# Altium project 100835_project.prjpcb (part 1 of 2)
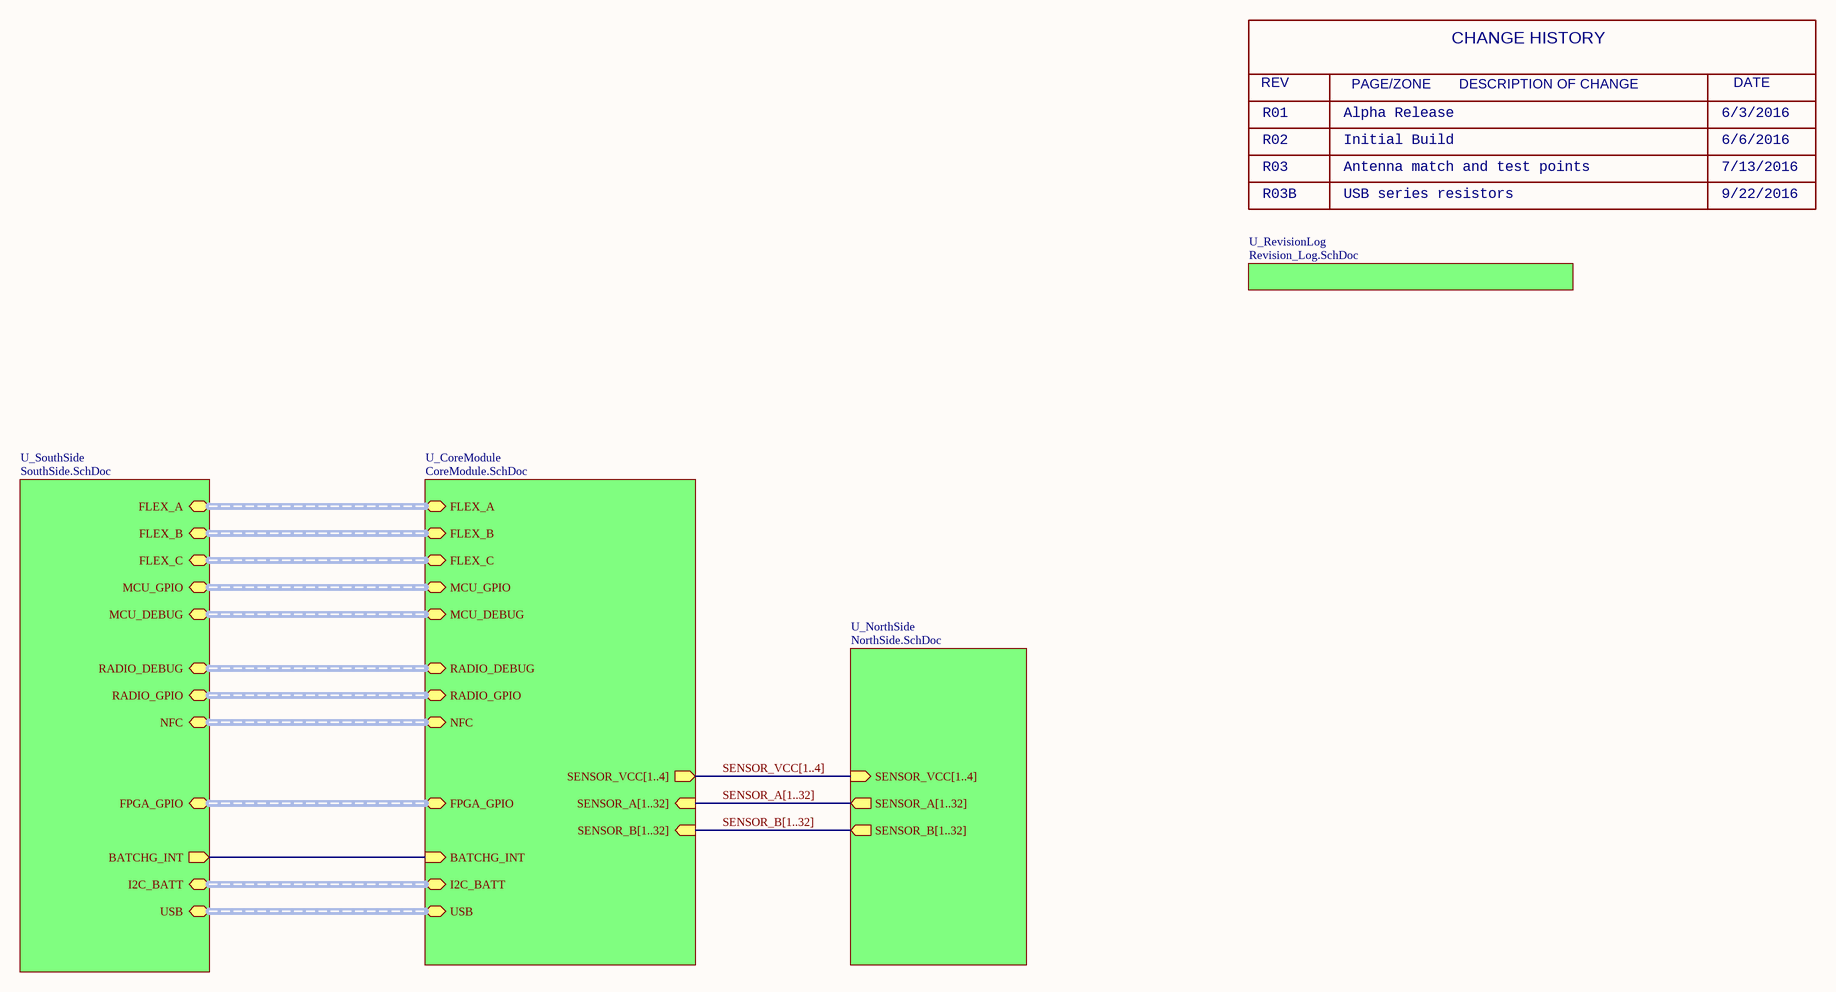
[diagram p0: CoreModuleTopLevel.SchDoc]
Sch_Revision: 03B; Project_Name: Watchman; PCB_Revision: 03; Board_Number: 100835; Board_Name: Core Module iCE40
10 sheets, 145 parts. Net scope: hierarchical (ports join the sheet entries above them; power ports are global).
Board file: 606-100835.PcbDoc
Sheets:
  CoreModuleTopLevel.SchDoc
    U_NorthSide = NorthSide.SchDoc
    U_CoreModule = CoreModule.SchDoc
      U_FPGA_Power = FPGA_Power.SchDoc
      U_FPGA_IO = FPGA_IO.SchDoc
      U_PowerCore = PowerCore.SchDoc
      U_MCU_IMU = MCU_IMU.SchDoc
      U_RADIO = Radio.SchDoc
    U_SouthSide = SouthSide.SchDoc
    U_RevisionLog = Revision_Log.SchDoc

## Sheet CoreModuleTopLevel.SchDoc: Block Diagram
size 431 x 279 mm; DrawnBy: D. Bruey, M.Ciuffo; Organization: Synapse Product Development, LLC.; Address1: 1511 6th Ave., Suite 400; Address2: Seattle, Washington 98101; Address3: 206.381.0898; Address4: www.synapse.com; DocumentNumber: 1; SheetNumber: 1; SheetTotal: 10; PageSetup: Record=PageOptions|CenterHorizontal=True|CenterVertical=True|PrintScale=1.06|XCorrection=1.00|YCorrection=1.00|PrintKind=1|BorderSize=5000000|LeftOffset=0|BottomOffset=0|Orientation=2|PaperLength=4318|PaperWidth=2794|Scale=100|PaperSource=7|PrintQuality=200|MediaType=1|DitherType=10|PrintScaleMode=1|PaperKind=11x17|PaperIndex=3

### Sub-sheets
U_CoreModule = CoreModule.SchDoc: SENSOR_VCC[1..4] (out), SENSOR_A[1..32] (in), SENSOR_B[1..32] (in), I2C_BATT (harness I2C), MCU_DEBUG (harness SWD), RADIO_DEBUG (harness SWD), USB (harness USB), MCU_GPIO (harness MCU_IO), FLEX_C (harness SPI), FLEX_B (harness SPI), FLEX_A (harness SPI), RADIO_GPIO (harness RADIO_IO), BATCHG_INT (in), FPGA_GPIO (harness FPGA_IO), NFC (harness NFC)
U_NorthSide = NorthSide.SchDoc: SENSOR_A[1..32] (out), SENSOR_B[1..32] (out), SENSOR_VCC[1..4] (in)
U_RevisionLog = Revision_Log.SchDoc: no entries
U_SouthSide = SouthSide.SchDoc: I2C_BATT (harness I2C), MCU_DEBUG (harness SWD), RADIO_DEBUG (harness SWD), USB (harness USB), MCU_GPIO (harness MCU_IO), FLEX_C (harness SPI), FLEX_B (harness SPI), FLEX_A (harness SPI), RADIO_GPIO (harness RADIO_IO), BATCHG_INT (out), FPGA_GPIO (harness FPGA_IO), NFC (harness NFC)

### Nets
BATCHG_INT: sheet U_CoreModule/BATCHG_INT, sheet U_SouthSide/BATCHG_INT

### Buses and harness runs
bus SENSOR_A[1..32] = sheet U_CoreModule/SENSOR_A[1..32] = sheet U_NorthSide/SENSOR_A[1..32]
bus SENSOR_B[1..32] = sheet U_CoreModule/SENSOR_B[1..32] = sheet U_NorthSide/SENSOR_B[1..32]
bus SENSOR_VCC[1..4] = sheet U_CoreModule/SENSOR_VCC[1..4] = sheet U_NorthSide/SENSOR_VCC[1..4]
harness sheet U_CoreModule/FLEX_A = sheet U_SouthSide/FLEX_A
harness sheet U_CoreModule/FLEX_B = sheet U_SouthSide/FLEX_B
harness sheet U_CoreModule/FLEX_C = sheet U_SouthSide/FLEX_C
harness sheet U_CoreModule/FPGA_GPIO = sheet U_SouthSide/FPGA_GPIO
harness sheet U_CoreModule/I2C_BATT = sheet U_SouthSide/I2C_BATT
harness sheet U_CoreModule/MCU_DEBUG = sheet U_SouthSide/MCU_DEBUG
harness sheet U_CoreModule/MCU_GPIO = sheet U_SouthSide/MCU_GPIO
harness sheet U_CoreModule/NFC = sheet U_SouthSide/NFC
harness sheet U_CoreModule/RADIO_DEBUG = sheet U_SouthSide/RADIO_DEBUG
harness sheet U_CoreModule/RADIO_GPIO = sheet U_SouthSide/RADIO_GPIO
harness sheet U_CoreModule/USB = sheet U_SouthSide/USB

### Notes on the sheet
- REV
- PAGE/ZONE       DESCRIPTION OF CHANGE
- CHANGE HISTORY
- DATE
- R01
- R02
- R03
- Alpha Release
- Initial Build
- Antenna match and test points
- 6/3/2016
- 6/6/2016
- 7/13/2016
- R03B
- USB series resistors
- 9/22/2016
- Design Notes:
- Layout Notes:
- Project:
- Sheet Title:
- PCBA:
- PROPRIETARY AND CONFIDENTIAL
- Drawn by:
- Schematic Part Number:
- Schematic Revision:
- Date:
- Sheet:
- /

## Sheet NorthSide.SchDoc: North Side Connector
size 431 x 279 mm; DrawnBy: D. Bruey, M.Ciuffo; Organization: Synapse Product Development, LLC.; Address1: 1511 6th Ave., Suite 400; Address2: Seattle, Washington 98101; Address3: 206.381.0898; Address4: www.synapse.com; DocumentNumber: 9; SheetNumber: 8; SheetTotal: 10; PageSetup: Record=PageOptions|CenterHorizontal=True|CenterVertical=True|PrintScale=1.06|XCorrection=1.00|YCorrection=1.00|PrintKind=1|BorderSize=5000000|LeftOffset=0|BottomOffset=0|Orientation=2|PaperLength=4318|PaperWidth=2794|Scale=100|PaperSource=7|PrintQuality=200|MediaType=1|DitherType=10|PrintScaleMode=1|PaperKind=11x17|PaperIndex=3
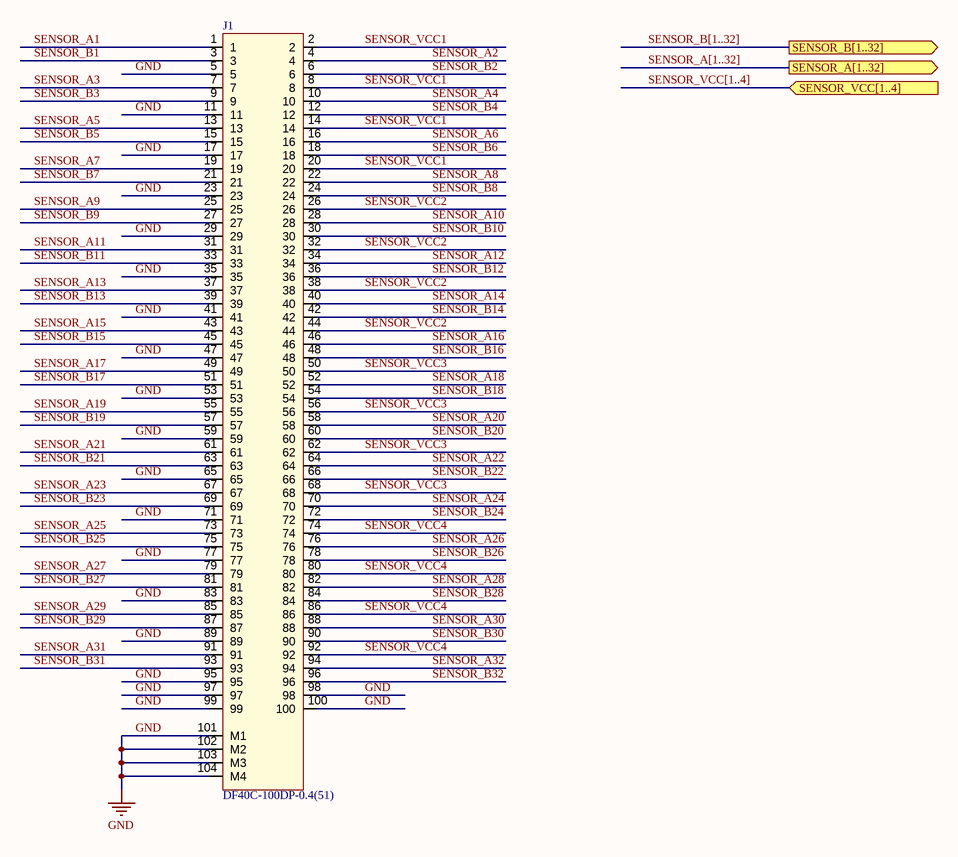
[diagram p1: NorthSide.SchDoc]

### Parts
J1  DF40C-100DP-0.4(51)  [con100_hirose-df40c-100dp_129h]

### Ports
SENSOR_A[1..32] (out), SENSOR_B[1..32] (out), SENSOR_VCC[1..4] (in)

### Nets
GND: J1.5 J1.11 J1.17 J1.23 J1.29 J1.35 J1.41 J1.47 J1.53 J1.59 J1.65 J1.71 J1.77 J1.83 J1.89 J1.95 J1.97 J1.98 J1.99 J1.100 J1.101(M1) J1.102(M2) J1.103(M3) J1.104(M4)
SENSOR_A1: J1.1
SENSOR_A2: J1.4
SENSOR_A3: J1.7
SENSOR_A4: J1.10
SENSOR_A5: J1.13
SENSOR_A6: J1.16
SENSOR_A7: J1.19
SENSOR_A8: J1.22
SENSOR_A9: J1.25
SENSOR_A10: J1.28
SENSOR_A11: J1.31
SENSOR_A12: J1.34
SENSOR_A13: J1.37
SENSOR_A14: J1.40
SENSOR_A15: J1.43
SENSOR_A16: J1.46
SENSOR_A17: J1.49
SENSOR_A18: J1.52
SENSOR_A19: J1.55
SENSOR_A20: J1.58
SENSOR_A21: J1.61
SENSOR_A22: J1.64
SENSOR_A23: J1.67
SENSOR_A24: J1.70
SENSOR_A25: J1.73
SENSOR_A26: J1.76
SENSOR_A27: J1.79
SENSOR_A28: J1.82
SENSOR_A29: J1.85
SENSOR_A30: J1.88
SENSOR_A31: J1.91
SENSOR_A32: J1.94
SENSOR_B1: J1.3
SENSOR_B2: J1.6
SENSOR_B3: J1.9
SENSOR_B4: J1.12
SENSOR_B5: J1.15
SENSOR_B6: J1.18
SENSOR_B7: J1.21
SENSOR_B8: J1.24
SENSOR_B9: J1.27
SENSOR_B10: J1.30
SENSOR_B11: J1.33
SENSOR_B12: J1.36
SENSOR_B13: J1.39
SENSOR_B14: J1.42
SENSOR_B15: J1.45
SENSOR_B16: J1.48
SENSOR_B17: J1.51
SENSOR_B18: J1.54
SENSOR_B19: J1.57
SENSOR_B20: J1.60
SENSOR_B21: J1.63
SENSOR_B22: J1.66
SENSOR_B23: J1.69
SENSOR_B24: J1.72
SENSOR_B25: J1.75
SENSOR_B26: J1.78
SENSOR_B27: J1.81
SENSOR_B28: J1.84
SENSOR_B29: J1.87
SENSOR_B30: J1.90
SENSOR_B31: J1.93
SENSOR_B32: J1.96
SENSOR_VCC1: J1.2 J1.8 J1.14 J1.20
SENSOR_VCC2: J1.26 J1.32 J1.38 J1.44
SENSOR_VCC3: J1.50 J1.56 J1.62 J1.68
SENSOR_VCC4: J1.74 J1.80 J1.86 J1.92

### Buses and harness runs
bus SENSOR_A[1..32] = port SENSOR_A[1..32]
bus SENSOR_B[1..32] = port SENSOR_B[1..32]
bus SENSOR_VCC[1..4] = port SENSOR_VCC[1..4]

### Notes on the sheet
- Design Notes:
- Layout Notes:
- Project:
- Sheet Title:
- PCBA:
- PROPRIETARY AND CONFIDENTIAL
- Drawn by:
- Schematic Part Number:
- Schematic Revision:
- Date:
- Sheet:
- /

### Library data of the parts
J1 = DF40C-100DP-0.4(51): CONN HDR 100POS 0.4MM SMD GOLD; part_type: connector; id: 1582; mfg: Hirose; dist: Digikey; dist_pn: H11614CT-ND; symbol: \\synapsedev.com\dfs\FS\EE_STUFF\CAD_LIB\MASTER\MASTER_CON\DF40C-100DP-0.4(51); voltage: 30V; positions: 100; TableName: viewAltiumConnectors; mfg_pn: DF40C-100DP-0.4(51); allegro_footprint: con100_hirose-df40c-100dp_129h; source_package: DF40C-100DP-0.4(51); height: 1.14mm; status: Unknown; datasheet: http://www.hirose.co.jp/cataloge_hp/ed_DF40_20140305.pdf

## Sheet CoreModule.SchDoc: Core Module
size 431 x 279 mm; DrawnBy: D. Bruey, M.Ciuffo; Organization: Synapse Product Development, LLC.; Address1: 1511 6th Ave., Suite 400; Address2: Seattle, Washington 98101; Address3: 206.381.0898; Address4: www.synapse.com; SheetNumber: 2; SheetTotal: 10; PageSetup: Record=PageOptions|CenterHorizontal=True|CenterVertical=True|PrintScale=1.06|XCorrection=1.00|YCorrection=1.00|PrintKind=1|BorderSize=5000000|LeftOffset=0|BottomOffset=0|Orientation=2|PaperLength=4318|PaperWidth=2794|Scale=100|PaperSource=7|PrintQuality=200|MediaType=1|DitherType=10|PrintScaleMode=1|PaperKind=11x17|PaperIndex=3
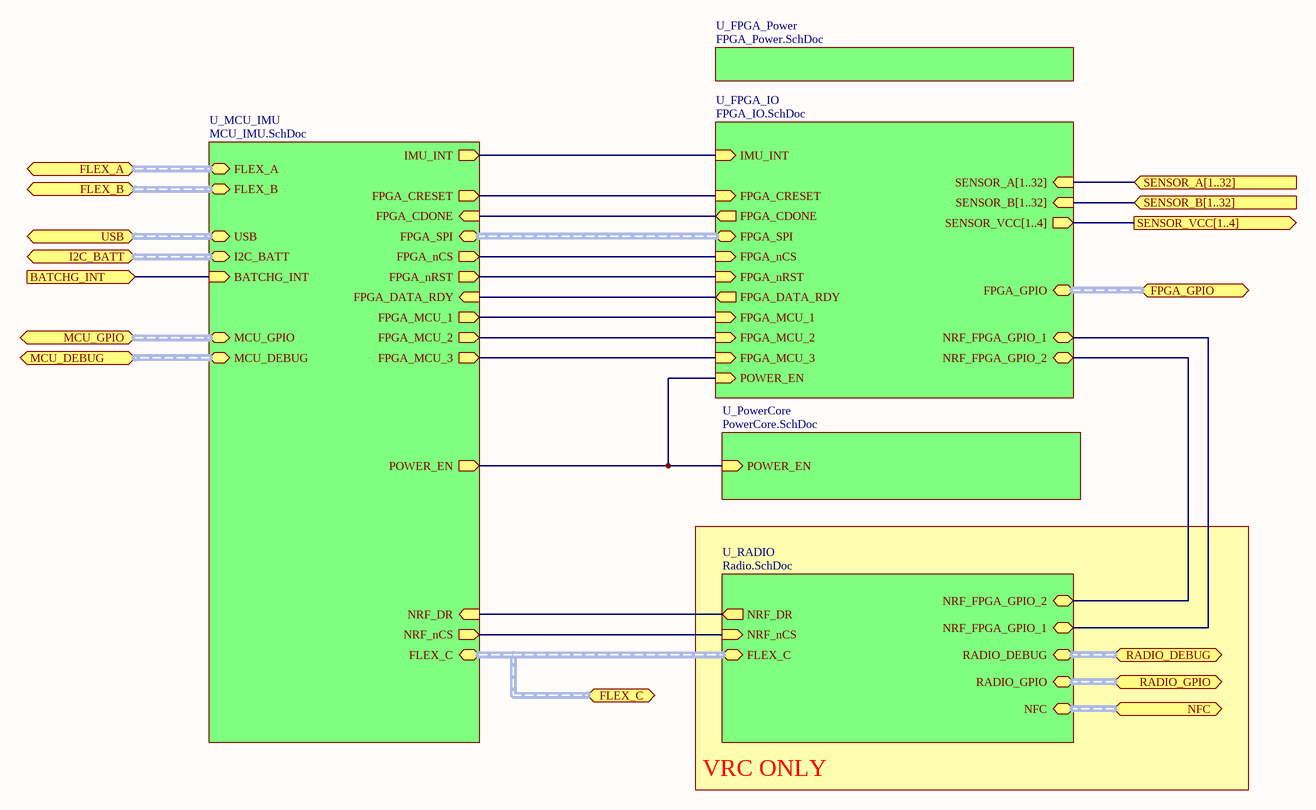
[diagram p2: CoreModule.SchDoc]

### Sub-sheets
U_FPGA_IO = FPGA_IO.SchDoc: FPGA_SPI (harness SPI), FPGA_nCS (in), IMU_INT (in), POWER_EN (in), FPGA_GPIO (harness FPGA_IO), FPGA_MCU_1 (in), FPGA_MCU_2 (in), FPGA_MCU_3 (in), FPGA_nRST (in), FPGA_CRESET (in), FPGA_DATA_RDY (out), FPGA_CDONE (out), NRF_FPGA_GPIO_1 (bidir), NRF_FPGA_GPIO_2 (bidir), SENSOR_VCC[1..4] (out), SENSOR_B[1..32] (in), SENSOR_A[1..32] (in)
U_FPGA_Power = FPGA_Power.SchDoc: no entries
U_MCU_IMU = MCU_IMU.SchDoc: I2C_BATT (harness I2C), USB (harness USB), FLEX_A (harness SPI), FLEX_B (harness SPI), FLEX_C (harness SPI), FPGA_SPI (harness SPI), FPGA_nCS (out), IMU_INT (out), POWER_EN (out), NRF_DR (in), MCU_GPIO (harness MCU_IO), NRF_nCS (out), BATCHG_INT (in), FPGA_MCU_1 (out), FPGA_MCU_2 (out), FPGA_MCU_3 (out), FPGA_nRST (out), FPGA_DATA_RDY (in), FPGA_CRESET (out), FPGA_CDONE (in), MCU_DEBUG (harness SWD)
U_PowerCore = PowerCore.SchDoc: POWER_EN (in)
U_RADIO = Radio.SchDoc: NRF_nCS (in), RADIO_DEBUG (harness SWD), FLEX_C (harness SPI), RADIO_GPIO (harness RADIO_IO), NFC (harness NFC), NRF_FPGA_GPIO_1 (bidir), NRF_FPGA_GPIO_2 (bidir), NRF_DR (out)

### Ports
BATCHG_INT (in), FLEX_A (harness SPI), FLEX_B (harness SPI), FLEX_C (harness SPI), FPGA_GPIO (harness FPGA_IO), I2C_BATT (harness I2C), MCU_DEBUG (harness SWD), MCU_GPIO (harness MCU_IO), NFC (harness NFC), RADIO_DEBUG (harness SWD), RADIO_GPIO (harness RADIO_IO), SENSOR_A[1..32] (in), SENSOR_B[1..32] (in), SENSOR_VCC[1..4] (out), USB (harness USB)

### Nets
BATCHG_INT: port BATCHG_INT, sheet U_MCU_IMU/BATCHG_INT
FPGA_CDONE: sheet U_FPGA_IO/FPGA_CDONE, sheet U_MCU_IMU/FPGA_CDONE
FPGA_CRESET: sheet U_FPGA_IO/FPGA_CRESET, sheet U_MCU_IMU/FPGA_CRESET
FPGA_DATA_RDY: sheet U_FPGA_IO/FPGA_DATA_RDY, sheet U_MCU_IMU/FPGA_DATA_RDY
FPGA_MCU_1: sheet U_FPGA_IO/FPGA_MCU_1, sheet U_MCU_IMU/FPGA_MCU_1
FPGA_MCU_2: sheet U_FPGA_IO/FPGA_MCU_2, sheet U_MCU_IMU/FPGA_MCU_2
FPGA_MCU_3: sheet U_FPGA_IO/FPGA_MCU_3, sheet U_MCU_IMU/FPGA_MCU_3
FPGA_nCS: sheet U_FPGA_IO/FPGA_nCS, sheet U_MCU_IMU/FPGA_nCS
FPGA_nRST: sheet U_FPGA_IO/FPGA_nRST, sheet U_MCU_IMU/FPGA_nRST
IMU_INT: sheet U_FPGA_IO/IMU_INT, sheet U_MCU_IMU/IMU_INT
NRF_DR: sheet U_MCU_IMU/NRF_DR, sheet U_RADIO/NRF_DR
NRF_FPGA_GPIO_1: sheet U_FPGA_IO/NRF_FPGA_GPIO_1, sheet U_RADIO/NRF_FPGA_GPIO_1
NRF_FPGA_GPIO_2: sheet U_FPGA_IO/NRF_FPGA_GPIO_2, sheet U_RADIO/NRF_FPGA_GPIO_2
NRF_nCS: sheet U_MCU_IMU/NRF_nCS, sheet U_RADIO/NRF_nCS
POWER_EN: sheet U_FPGA_IO/POWER_EN, sheet U_PowerCore/POWER_EN, sheet U_MCU_IMU/POWER_EN

### Buses and harness runs
bus port SENSOR_A[1..32] = sheet U_FPGA_IO/SENSOR_A[1..32]
bus port SENSOR_B[1..32] = sheet U_FPGA_IO/SENSOR_B[1..32]
bus port SENSOR_VCC[1..4] = sheet U_FPGA_IO/SENSOR_VCC[1..4]
harness port FLEX_A = sheet U_MCU_IMU/FLEX_A
harness port FLEX_B = sheet U_MCU_IMU/FLEX_B
harness port FLEX_C = sheet U_MCU_IMU/FLEX_C = sheet U_RADIO/FLEX_C
harness port FPGA_GPIO = sheet U_FPGA_IO/FPGA_GPIO
harness port I2C_BATT = sheet U_MCU_IMU/I2C_BATT
harness port MCU_DEBUG = sheet U_MCU_IMU/MCU_DEBUG
harness port MCU_GPIO = sheet U_MCU_IMU/MCU_GPIO
harness port NFC = sheet U_RADIO/NFC
harness port RADIO_DEBUG = sheet U_RADIO/RADIO_DEBUG
harness port RADIO_GPIO = sheet U_RADIO/RADIO_GPIO
harness port USB = sheet U_MCU_IMU/USB
harness sheet U_FPGA_IO/FPGA_SPI = sheet U_MCU_IMU/FPGA_SPI

### Notes on the sheet
- VRC ONLY
- Design Notes:
- Layout Notes:
- Project:
- Sheet Title:
- PCBA:
- PROPRIETARY AND CONFIDENTIAL
- Drawn by:
- Schematic Part Number:
- Schematic Revision:
- Date:
- Sheet:
- /

## Sheet FPGA_Power.SchDoc: FPGA Power
size 431 x 279 mm; DrawnBy: D. Bruey, M.Ciuffo; Organization: Synapse Product Development, LLC.; Address1: 1511 6th Ave., Suite 400; Address2: Seattle, Washington 98101; Address3: 206.381.0898; Address4: www.synapse.com; DocumentNumber: 4; SheetNumber: 4; SheetTotal: 10; PageSetup: Record=PageOptions|CenterHorizontal=True|CenterVertical=True|PrintScale=1.06|XCorrection=1.00|YCorrection=1.00|PrintKind=1|BorderSize=5000000|LeftOffset=0|BottomOffset=0|Orientation=2|PaperLength=4318|PaperWidth=2794|Scale=100|PaperSource=7|PrintQuality=200|MediaType=1|DitherType=10|PrintScaleMode=1|PaperKind=11x17|PaperIndex=3
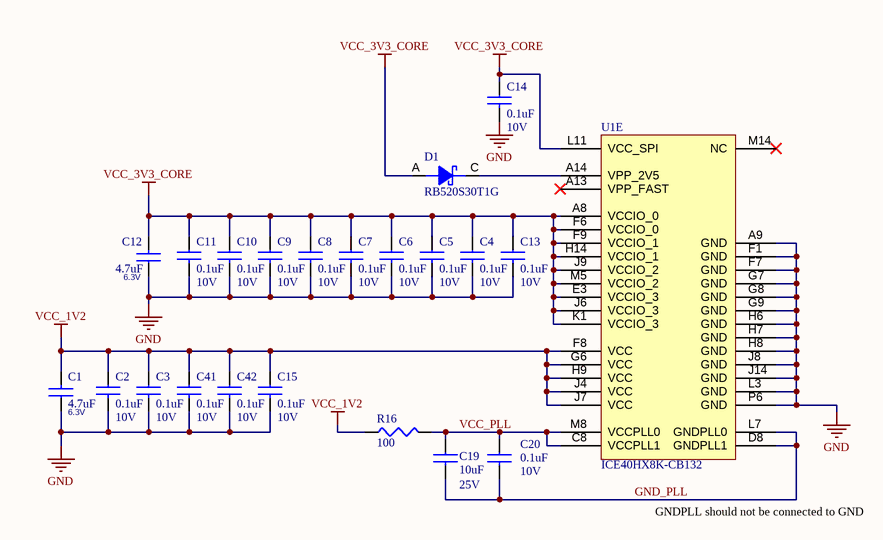
[diagram p3: FPGA_Power.SchDoc]

### Parts
C1  4.7uF  Voltage: 6.3V  [0402-IPCsm_55]
C2  0.1uF  Voltage: 10V  [0201-IPCsm_33]
C3  0.1uF  Voltage: 10V  [0201-IPCsm_33]
C4  0.1uF  Voltage: 10V  [0201-IPCsm_33]
C5  0.1uF  Voltage: 10V  [0201-IPCsm_33]
C6  0.1uF  Voltage: 10V  [0201-IPCsm_33]
C7  0.1uF  Voltage: 10V  [0201-IPCsm_33]
C8  0.1uF  Voltage: 10V  [0201-IPCsm_33]
C9  0.1uF  Voltage: 10V  [0201-IPCsm_33]
C10  0.1uF  Voltage: 10V  [0201-IPCsm_33]
C11  0.1uF  Voltage: 10V  [0201-IPCsm_33]
C12  4.7uF  Voltage: 6.3V  [0402-IPCsm_55]
C13  0.1uF  Voltage: 10V  [0201-IPCsm_33]
C14  0.1uF  Voltage: 10V  [0201-IPCsm_33]
C15  0.1uF  Voltage: 10V  [0201-IPCsm_33]
C19  10uF  Voltage: 25V  [0603-ipcsm_90]
C20  0.1uF  Voltage: 10V  [0201-IPCsm_33]
C41  0.1uF  Voltage: 10V  [0201-IPCsm_33]
C42  0.1uF  Voltage: 10V  [0201-IPCsm_33]
D1  RB520S30T1G  [SOD523]
R16  100  [0201-IPCsm_26]
U1  ICE40HX8K-CB132  [LATC-csBGA-132]  (part E of 5)

### Nets
GND: C1.1 C2.2 C3.2 C4.2 C5.2 C6.2 C7.2 C8.2 C9.2 C10.2 C11.2 C12.1 C13.2 C14.2 C15.2 C41.2 C42.2 U1.A9(GND) U1.F1(GND) U1.F7(GND) U1.G7(GND) U1.G8(GND) U1.G9(GND) U1.H6(GND) U1.H7(GND) U1.H8(GND) U1.J8(GND) U1.J14(GND) U1.L3(GND) U1.P6(GND)
VCC_1V2: C1.2 C2.1 C3.1 C15.1 C41.1 C42.1 R16.1 U1.F8(VCC) U1.G6(VCC) U1.H9(VCC) U1.J4(VCC) U1.J7(VCC)
VCC_3V3_CORE: C4.1 C5.1 C6.1 C7.1 C8.1 C9.1 C10.1 C11.1 C12.2 C13.1 C14.1 D1.A U1.A8(VCCIO_0) U1.E3(VCCIO_3) U1.F6(VCCIO_0) U1.F9(VCCIO_1) U1.H14(VCCIO_1) U1.J6(VCCIO_3) U1.J9(VCCIO_2) U1.K1(VCCIO_3) U1.L11(VCC_SPI) U1.M5(VCCIO_2)
GND_PLL: C19.2 C20.2 U1.D8(GNDPLL1) U1.L7(GNDPLL0)
VCC_PLL: C19.1 C20.1 R16.2 U1.C8(VCCPLL1) U1.M8(VCCPLL0)
NetD1_C: D1.C U1.A14(VPP_2V5)

Not connected (* = marked no-connect by the designer): U1 A13(VPP_FAST)* M14(NC)*

### Notes on the sheet
- GNDPLL should not be connected to GND
- Design Notes:
- Layout Notes:
- Project:
- Sheet Title:
- PCBA:
- PROPRIETARY AND CONFIDENTIAL
- Drawn by:
- Schematic Part Number:
- Schematic Revision:
- Date:
- Sheet:
- /

### Library data of the parts
C1 C12 = GRM155R60J475ME47D: CAP CER 4.7UF 6.3V 20% X5R 0402; part_type: capacitor; id: 855; mfg: MURATA; dist: DIGIKEY; dist_pn: 490-5915-1-ND; symbol: \\SYNAPSEDEV.COM\DFS\FS\EE_STUFF\CAD_LIB\MASTER\MASTER_DISCRETE\CAP; allegro_footprint: 0402-IPCsm_55,c-0402_22H; source_package: C_4P7U_6.3V_X5R_0402; OrCADSymbol: MASTER_DISCRETE\CAP; TableName: viewAltiumCapacitors; mfg_pn: GRM155R60J475ME47D; type: X5R; tolerance: 20%; height: 0.55MM; status: Unknown; SymbolPath: C:\EE-Vault\Libraries\Schematic\MASTER_DISCRETE\CAP
C2-C11 C13-C15 C20 C41 C42 = CL03A104KP3NNNC: CAP CER 0.1UF 10V 10% X5R 0201; part_type: capacitor; id: 1260; mfg: Samsung Electro-Mechanics America, Inc; dist: DIGIKEY; dist_pn: 1276-1115-2-ND; source_package: C_1U_10V_X5R_0201; TableName: viewAltiumCapacitors; mfg_pn: CL03A104KP3NNNC; type: X5R; tolerance: 10%; height: 0.33mm; status: Unknown
C19 = CL10A106MA8NRNC: CAP CER 10UF 25V 20% X5R 0603; part_type: capacitor; id: 1157; mfg: Samsung Electro-Mechanics America, Inc; dist: Digikey; dist_pn: 1276-1869-1-ND; TableName: viewAltiumCapacitors; mfg_pn: CL10A106MA8NRNC; type: X5R; tolerance: 20%; height: 0.9MM; status: Unknown
D1 = RB520S30T1G: DIODE SCHOTTKY 30V 200MA SOD523; id: 1259; mfg: On Semiconductor; dist: Digikey; dist_pn: RB520S30T1GOSCT-ND; source_package: SOD-523; power: 200mW; current: 0.2A; TableName: viewAltiumDiscretes; mfg_pn: RB520S30T1G; part_type: Diode; voltage: 30V; type: SCHOTTKY; height: 0.7mm; status: Unknown
R16 = RC0201FR-07100RL: RES 100 OHM 1/20W 1% 0201 SMD; part_type: resistor; Tolerance: 1.00%; Voltage: 50V; DIST: DIGIKEY; MFG: YAGEO; DIST_PN: 311-100MCT-ND; Power: 0.05W; id: 2416; source_package: R_100_0201_1P; TableName: viewAltiumResistors; Height: 0.26MM; MFG_PN: RC0201FR-07100RL; status: Unknown; datasheet: http://www.yageo.com/documents/recent/PYu-RC_Group_51_RoHS_L_04.pdf
U1 = ICE40HX8K-CB132: IC FPGA 95 I/O 132CBGA; id: 2469; mfg: Lattice Semiconductor Corporation; dist: Digikey; dist_pn: 220-1577-ND; source_package: ICE40HX8K_CB132; voltage: 1.2-3.3v; TableName: viewAltiumIcs; mfg_pn: ICE40HX8K-CB132; part_type: ic; height: 1mm; status: Unknown

## Sheet FPGA_IO.SchDoc: FPGA IO
size 431 x 279 mm; DrawnBy: D. Bruey, M.Ciuffo; Organization: Synapse Product Development, LLC.; Address1: 1511 6th Ave., Suite 400; Address2: Seattle, Washington 98101; Address3: 206.381.0898; Address4: www.synapse.com; DocumentNumber: 5; SheetNumber: 3; SheetTotal: 10; PageSetup: Record=PageOptions|CenterHorizontal=True|CenterVertical=True|PrintScale=1.06|XCorrection=1.00|YCorrection=1.00|PrintKind=1|BorderSize=5000000|LeftOffset=0|BottomOffset=0|Orientation=2|PaperLength=4318|PaperWidth=2794|Scale=100|PaperSource=7|PrintQuality=200|MediaType=1|DitherType=10|PrintScaleMode=1|PaperKind=11x17|PaperIndex=3
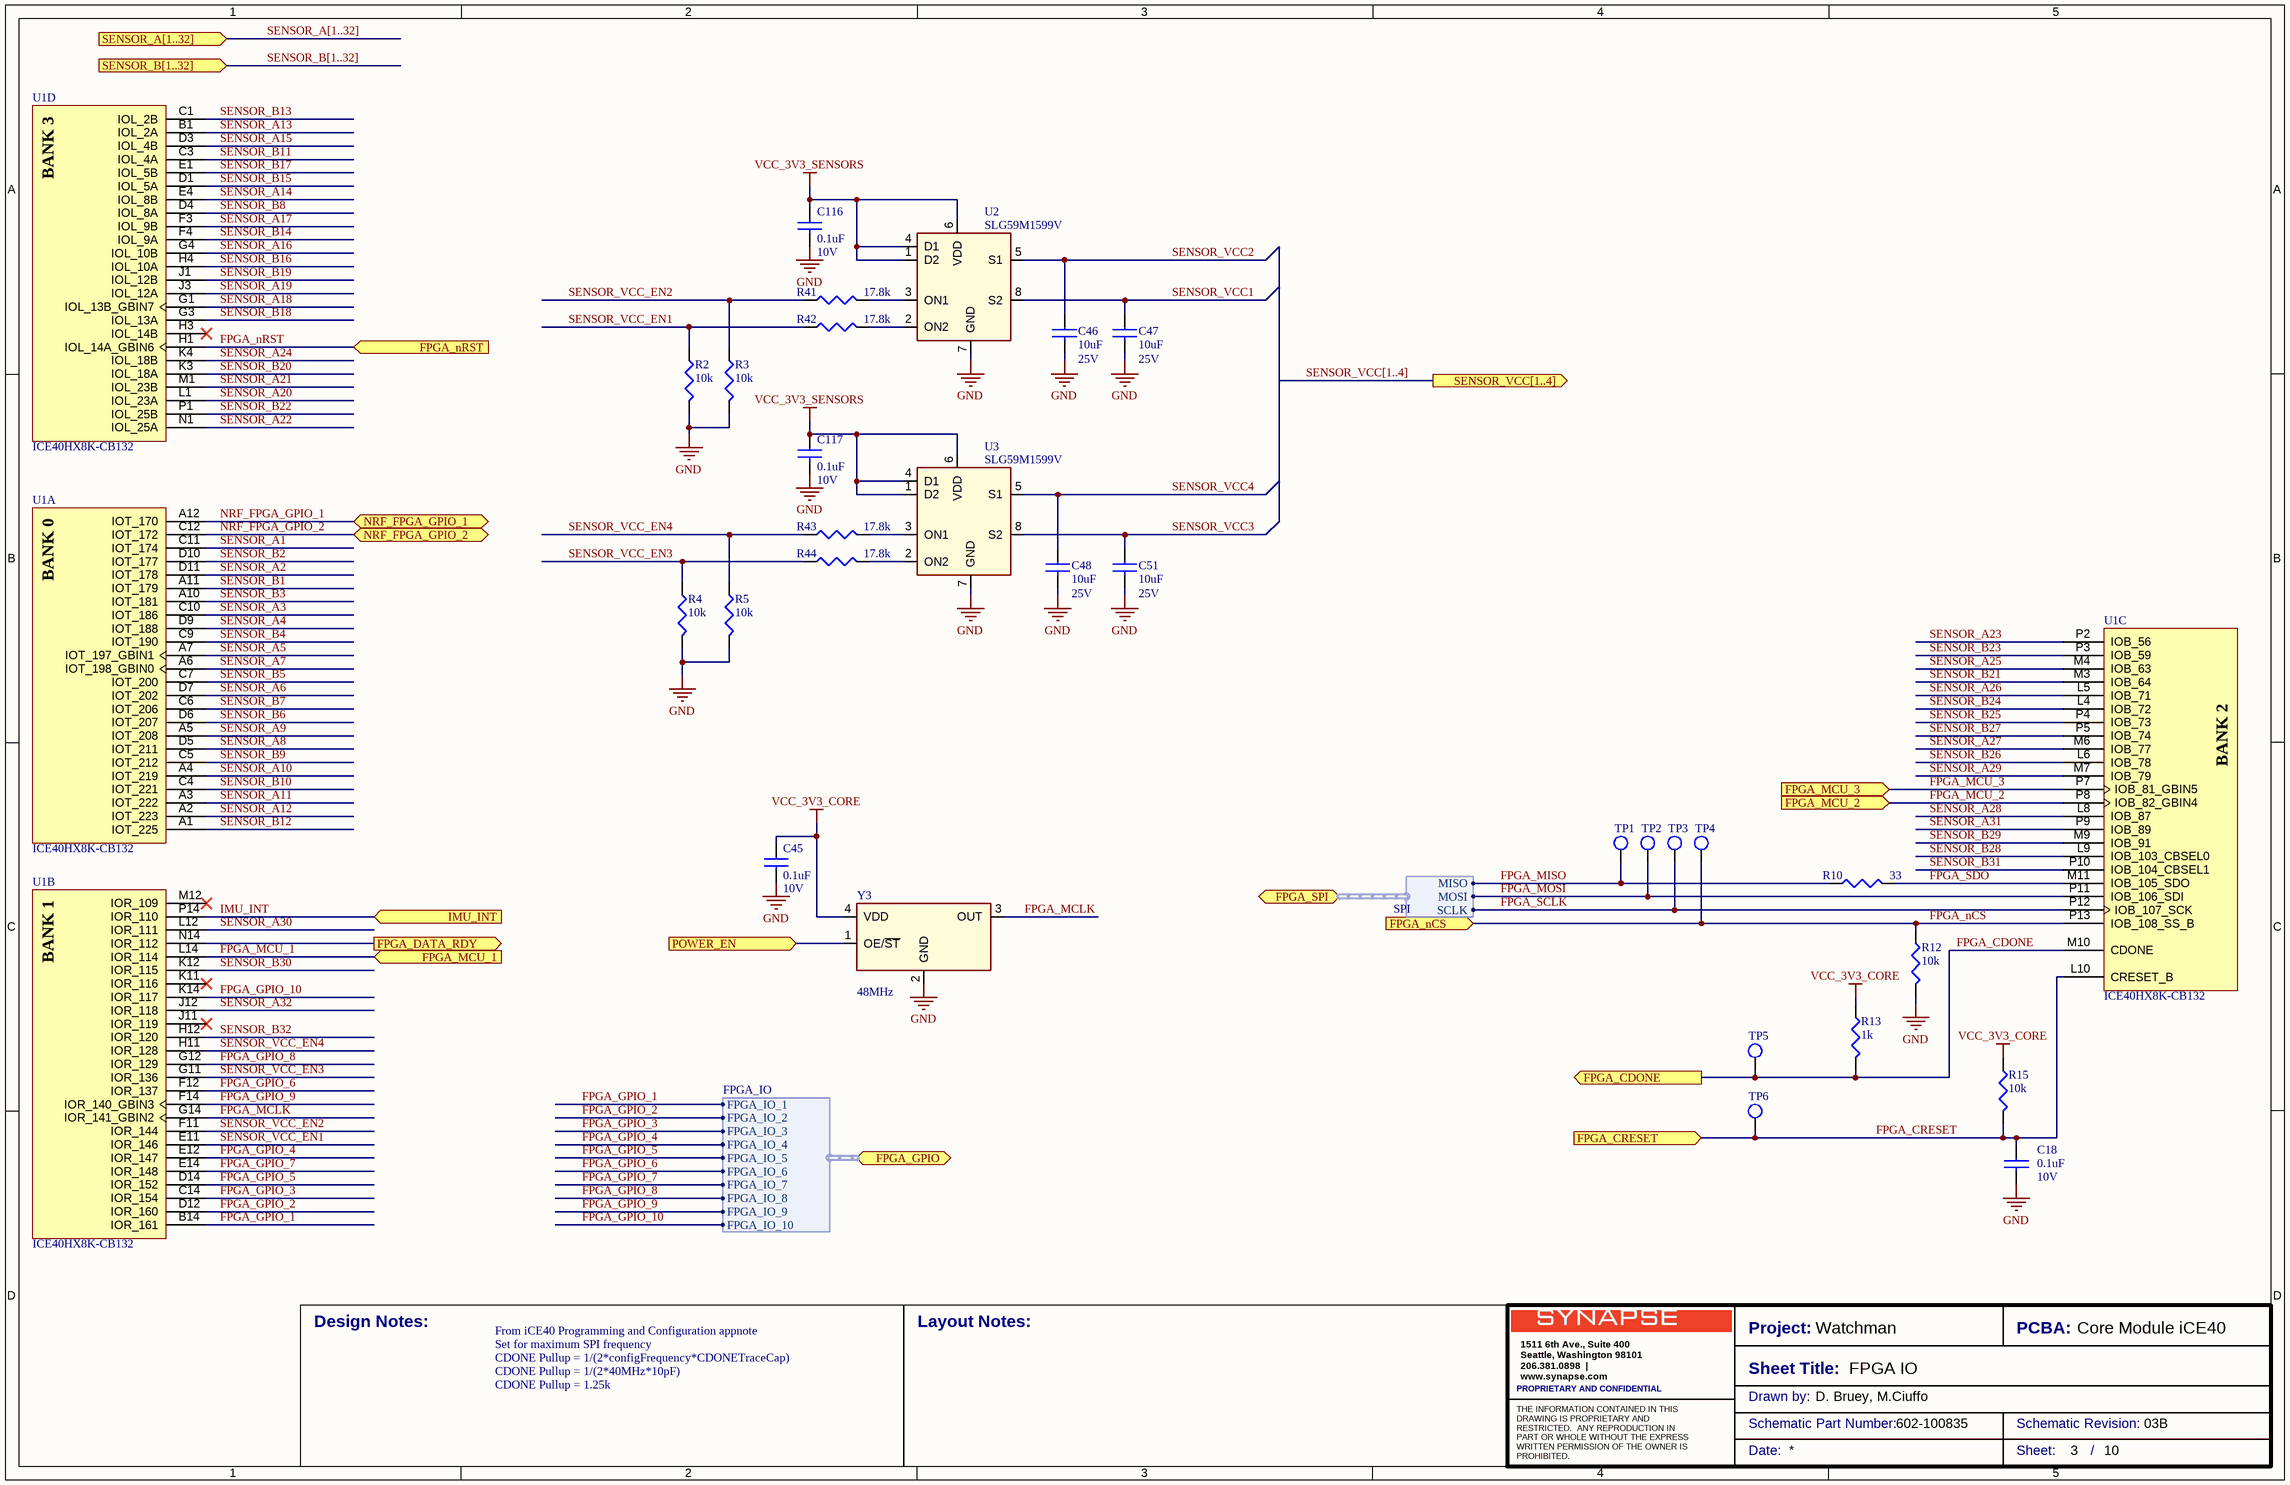
[diagram p4: FPGA_IO.SchDoc]

### Parts
C18  0.1uF  Voltage: 10V  [0201-IPCsm_33]
C45  0.1uF  Voltage: 10V  [0201-IPCsm_33]
C46  10uF  Voltage: 25V  [0603-ipcsm_90]
C47  10uF  Voltage: 25V  [0603-ipcsm_90]
C48  10uF  Voltage: 25V  [0603-ipcsm_90]
C51  10uF  Voltage: 25V  [0603-ipcsm_90]
C116  0.1uF  Voltage: 10V  [0201-IPCsm_33]
C117  0.1uF  Voltage: 10V  [0201-IPCsm_33]
R2  10k  [0201-IPCsm_26]
R3  10k  [0201-IPCsm_26]
R4  10k  [0201-IPCsm_26]
R5  10k  [0201-IPCsm_26]
R10  33  [0201-IPCsm_26]
R12  10k  [0201-IPCsm_26]
R13  1k  [0201-IPCsm_26]
R15  10k  [0201-IPCsm_26]
R41  17.8k  [0201-IPCsm_26]
R42  17.8k  [0201-IPCsm_26]
R43  17.8k  [0201-IPCsm_26]
R44  17.8k  [0201-IPCsm_26]
TP1  tp-1mm  [TP-S100_SMT]  (value not drawn)  (no BOM)
TP2  tp-1mm  [TP-S100_SMT]  (value not drawn)  (no BOM)
TP3  tp-1mm  [TP-S100_SMT]  (value not drawn)  (no BOM)
TP4  tp-1mm  [TP-S100_SMT]  (value not drawn)  (no BOM)
TP5  tp-1mm  [TP-S100_SMT]  (value not drawn)  (no BOM)
TP6  tp-1mm  [TP-S100_SMT]  (value not drawn)  (no BOM)
U1  ICE40HX8K-CB132  [LATC-csBGA-132]  (parts A,B,C,D of 5)
U2  SLG59M1599V  [STDFN8_SLG59M1599V]
U3  SLG59M1599V  [STDFN8_SLG59M1599V]
Y3  48MHz  [XTAL_SiT1602_250x200x80]

### Ports
FPGA_CDONE (out), FPGA_CRESET (in), FPGA_DATA_RDY (out), FPGA_GPIO (harness FPGA_IO), FPGA_MCU_1 (in), FPGA_MCU_2 (in), FPGA_MCU_3 (in), FPGA_nCS (in), FPGA_nRST (in), FPGA_SPI (harness SPI), IMU_INT (in), NRF_FPGA_GPIO_1 (bidir), NRF_FPGA_GPIO_2 (bidir), POWER_EN (in), SENSOR_A[1..32] (in), SENSOR_B[1..32] (in), SENSOR_VCC[1..4] (out)

### Harnesses
SPI: MOSI, MISO, SCLK
FPGA_IO: FPGA_IO_2, FPGA_IO_3, FPGA_IO_4, FPGA_IO_5, FPGA_IO_6, FPGA_IO_7, FPGA_IO_8, FPGA_IO_9, FPGA_IO_10, FPGA_IO_1

### Nets
GND: C18.2 C45.2 C46.2 C47.2 C48.2 C51.2 C116.2 C117.2 R2.2 R3.2 R4.2 R5.2 R12.2 U2.7(GND) U3.7(GND) Y3.2(GND)
VCC_3V3_CORE: C45.1 R13.1 R15.1 Y3.4(VDD)
VCC_3V3_SENSORS: C116.1 C117.1 U2.1(D2) U2.4(D1) U2.6(VDD) U3.1(D2) U3.4(D1) U3.6(VDD)
FPGA_CDONE: R13.2 TP5.1(TP) U1.M10(CDONE) ; port FPGA_CDONE
FPGA_CRESET: C18.1 R15.2 TP6.1(TP) U1.L10(CRESET_B) ; port FPGA_CRESET
FPGA_DATA_RDY: U1.N14(IOR_112) ; port FPGA_DATA_RDY
FPGA_GPIO_1: U1.B14(IOR_161) ; port FPGA_GPIO.FPGA_IO_1
FPGA_GPIO_2: U1.D12(IOR_160) ; port FPGA_GPIO.FPGA_IO_2
FPGA_GPIO_3: U1.C14(IOR_154) ; port FPGA_GPIO.FPGA_IO_3
FPGA_GPIO_4: U1.E12(IOR_147) ; port FPGA_GPIO.FPGA_IO_4
FPGA_GPIO_5: U1.D14(IOR_152) ; port FPGA_GPIO.FPGA_IO_5
FPGA_GPIO_6: U1.F12(IOR_137) ; port FPGA_GPIO.FPGA_IO_6
FPGA_GPIO_7: U1.E14(IOR_148) ; port FPGA_GPIO.FPGA_IO_7
FPGA_GPIO_8: U1.G12(IOR_129) ; port FPGA_GPIO.FPGA_IO_8
FPGA_GPIO_9: U1.F14(IOR_140_GBIN3) ; port FPGA_GPIO.FPGA_IO_9
FPGA_GPIO_10: U1.K14(IOR_117) ; port FPGA_GPIO.FPGA_IO_10
FPGA_MCLK: U1.G14(IOR_141_GBIN2) Y3.3(OUT)
FPGA_MCU_1: U1.L14(IOR_114) ; port FPGA_MCU_1
FPGA_MCU_2: U1.P8(IOB_82_GBIN4) ; port FPGA_MCU_2
FPGA_MCU_3: U1.P7(IOB_81_GBIN5) ; port FPGA_MCU_3
FPGA_MISO: R10.1 TP1.1(TP) ; port FPGA_SPI.MISO
FPGA_MOSI: TP2.1(TP) U1.P11(IOB_106_SDI) ; port FPGA_SPI.MOSI
FPGA_nCS: R12.1 TP4.1(TP) U1.P13(IOB_108_SS_B) ; port FPGA_nCS
FPGA_nRST: U1.H1(IOL_14A_GBIN6) ; port FPGA_nRST
FPGA_SCLK: TP3.1(TP) U1.P12(IOB_107_SCK) ; port FPGA_SPI.SCLK
FPGA_SDO: R10.2 U1.M11(IOB_105_SDO)
IMU_INT: U1.P14(IOR_110) ; port IMU_INT
NRF_FPGA_GPIO_1: U1.A12(IOT_170) ; port NRF_FPGA_GPIO_1
NRF_FPGA_GPIO_2: U1.C12(IOT_172) ; port NRF_FPGA_GPIO_2
POWER_EN: Y3.1(OE/~{ST}) ; port POWER_EN
SENSOR_A1: U1.C11(IOT_174)
SENSOR_A2: U1.D11(IOT_178)
SENSOR_A3: U1.C10(IOT_186)
SENSOR_A4: U1.D9(IOT_188)
SENSOR_A5: U1.A7(IOT_197_GBIN1)
SENSOR_A6: U1.D7(IOT_202)
SENSOR_A7: U1.A6(IOT_198_GBIN0)
SENSOR_A8: U1.D5(IOT_211)
SENSOR_A9: U1.A5(IOT_208)
SENSOR_A10: U1.A4(IOT_219)
SENSOR_A11: U1.A3(IOT_222)
SENSOR_A12: U1.A2(IOT_223)
SENSOR_A13: U1.B1(IOL_2A)
SENSOR_A14: U1.E4(IOL_8B)
SENSOR_A15: U1.D3(IOL_4B)
SENSOR_A16: U1.G4(IOL_10B)
SENSOR_A17: U1.F3(IOL_9B)
SENSOR_A18: U1.G1(IOL_13B_GBIN7)
SENSOR_A19: U1.J3(IOL_12A)
SENSOR_A20: U1.L1(IOL_23A)
SENSOR_A21: U1.M1(IOL_23B)
SENSOR_A22: U1.N1(IOL_25A)
SENSOR_A23: U1.P2(IOB_56)
SENSOR_A24: U1.K4(IOL_18B)
SENSOR_A25: U1.M4(IOB_63)
SENSOR_A26: U1.L5(IOB_71)
SENSOR_A27: U1.M6(IOB_77)
SENSOR_A28: U1.L8(IOB_87)
SENSOR_A29: U1.M7(IOB_79)
SENSOR_A30: U1.L12(IOR_111)
SENSOR_A31: U1.P9(IOB_89)
SENSOR_A32: U1.J12(IOR_118)
SENSOR_B1: U1.A11(IOT_179)
SENSOR_B2: U1.D10(IOT_177)
SENSOR_B3: U1.A10(IOT_181)
SENSOR_B4: U1.C9(IOT_190)
SENSOR_B5: U1.C7(IOT_200)
SENSOR_B6: U1.D6(IOT_207)
SENSOR_B7: U1.C6(IOT_206)
SENSOR_B8: U1.D4(IOL_8A)
SENSOR_B9: U1.C5(IOT_212)
SENSOR_B10: U1.C4(IOT_221)
SENSOR_B11: U1.C3(IOL_4A)
SENSOR_B12: U1.A1(IOT_225)
SENSOR_B13: U1.C1(IOL_2B)
SENSOR_B14: U1.F4(IOL_9A)
SENSOR_B15: U1.D1(IOL_5A)
SENSOR_B16: U1.H4(IOL_10A)
SENSOR_B17: U1.E1(IOL_5B)
SENSOR_B18: U1.G3(IOL_13A)
SENSOR_B19: U1.J1(IOL_12B)
SENSOR_B20: U1.K3(IOL_18A)
SENSOR_B21: U1.M3(IOB_64)
SENSOR_B22: U1.P1(IOL_25B)
SENSOR_B23: U1.P3(IOB_59)
SENSOR_B24: U1.L4(IOB_72)
SENSOR_B25: U1.P4(IOB_73)
SENSOR_B26: U1.L6(IOB_78)
SENSOR_B27: U1.P5(IOB_74)
SENSOR_B28: U1.L9(IOB_103_CBSEL0)
SENSOR_B29: U1.M9(IOB_91)
SENSOR_B30: U1.K12(IOR_115)
SENSOR_B31: U1.P10(IOB_104_CBSEL1)
SENSOR_B32: U1.H12(IOR_120)
SENSOR_VCC1: C47.1 U2.8(S2)
SENSOR_VCC2: C46.1 U2.5(S1)
SENSOR_VCC3: C51.1 U3.8(S2)
SENSOR_VCC4: C48.1 U3.5(S1)
SENSOR_VCC_EN1: R2.1 R42.1 U1.E11(IOR_146)
SENSOR_VCC_EN2: R3.1 R41.1 U1.F11(IOR_144)
SENSOR_VCC_EN3: R4.1 R44.1 U1.G11(IOR_136)
SENSOR_VCC_EN4: R5.1 R43.1 U1.H11(IOR_128)
NetR41_2: R41.2 U2.3(ON1)
NetR42_2: R42.2 U2.2(ON2)
NetR43_2: R43.2 U3.3(ON1)
NetR44_2: R44.2 U3.2(ON2)

Not connected (* = marked no-connect by the designer): U1 H3(IOL_14B)* J11(IOR_119)* K11(IOR_116)* M12(IOR_109)*

### Buses and harness runs
bus SENSOR_A[1..32] = port SENSOR_A[1..32]
bus SENSOR_B[1..32] = port SENSOR_B[1..32]
bus SENSOR_VCC[1..4] = port SENSOR_VCC[1..4]

### Notes on the sheet
- CDONE Pullup = 1/(2*configFrequency*CDONETraceCap)
- CDONE Pullup = 1/(2*40MHz*10pF)
- From iCE40 Programming and Configuration appnote
- Set for maximum SPI frequency
- CDONE Pullup = 1.25k
- Design Notes:
- Layout Notes:
- Project:
- Sheet Title:
- PCBA:
- PROPRIETARY AND CONFIDENTIAL
- Drawn by:
- Schematic Part Number:
- Schematic Revision:
- Date:
- Sheet:
- /
- (in symbol ICE40HX8K-CB132, part A) BANK 0
- (in symbol ICE40HX8K-CB132, part B) BANK 1
- (in symbol ICE40HX8K-CB132, part C) BANK 2
- (in symbol ICE40HX8K-CB132, part D) BANK 3

### Library data of the parts
C18 C45 C116 C117 = CL03A104KP3NNNC: as C2 on sheet FPGA_Power; mfg_pn: CL03A104KP3NNNC; type: X5R; tolerance: 10%; height: 0.33mm; status: Unknown
C46-C48 C51 = CL10A106MA8NRNC: as C19 on sheet FPGA_Power; mfg_pn: CL10A106MA8NRNC; type: X5R; tolerance: 20%; height: 0.9MM; status: Unknown
R2-R5 R12 R15 = RC0201FR-0710KL: RES 10K OHM 1/20W 1% 0201 SMD; part_type: resistor; Tolerance: 1.00%; Voltage: 50V; DIST: DIGIKEY; MFG: YAGEO; DIST_PN: 311-10.0KMCT-ND; Power: 0.05W; id: 1527; source_package: R_10k_0201_1P; TableName: viewAltiumResistors; Height: .26MM; MFG_PN: RC0201FR-0710KL; status: Unknown
R10 = RC0201FR-0733R: RES 33 OHM 1/20W 1% 0201 SMD; part_type: resistor; Tolerance: 1.00%; Voltage: 50V; DIST: DIGIKEY; MFG: YAGEO; DIST_PN: 311-33.0MCT-ND; Power: 0.05W; id: 1544; source_package: R_33_0201_1P; TableName: viewAltiumResistors; Height: .26MM; MFG_PN: RC0201FR-0733R; status: Unknown
R13 = ERJ-1GEF1001C: RES 1.00K OHM 1/20W 1% 0201 SMD; part_type: resistor; Tolerance: 1.00%; Voltage: 15V; DIST: Digikey; MFG: Panasonic; DIST_PN: P1.00KABDKR-ND; Power: 0.05W; id: 1100; source_package: R_1k_1p_0201; TableName: viewAltiumResistors; Height: 0.26MM; MFG_PN: ERJ-1GEF1001C; status: Unknown
R41-R44 = ERJ-1GEF1782C: RES SMD 17.8K OHM 1% 1/20W 0201; part_type: resistor; Tolerance: 1.00%; DIST: DIGIKEY; MFG: PANASONIC; DIST_PN: P17.8KABCT-ND; Power: 0.05W; id: 2379; TableName: viewAltiumResistors; Height: 0.26MM; MFG_PN: ERJ-1GEF1782C; status: Unknown
TP1-TP6 = TP0042: TESTPOINT, 1MM SMD, Square pad, Round SM opening; part_type: test_point; mfg_pn: TP0042; mfg: NA; id: 888; TableName: viewAltiumMisc; dist: NA; dist_pn: NA; source_package: tp_smt; status: Unknown
U1 = ICE40HX8K-CB132: as U1 on sheet FPGA_Power; mfg_pn: ICE40HX8K-CB132; part_type: ic; height: 1mm; status: Unknown
U2 U3 = SLG59M1599V: Dual 40mohm 1A Load Switch; part_type: ic; id: 2416; mfg: Silego; voltage: 2.5-5.5V; TableName: viewAltiumIcs; mfg_pn: SLG59M1599V; dist: Silego; dist_pn: SLG59M1599V; source_package: SLG59M1599V; height: .55mm; status: Good
Y3 = SIT1602AI-12-33E-48.000000G: OSC MEMS 48.000MHZ H/LV-CMOS SMD; id: 1179; mfg: SiTime; dist: DigiKey; dist_pn: 1473-1062-1-ND; voltage: 3.3V; tolerance: 25ppm; TableName: viewAltiumMisc; mfg_pn: SIT1602AI-12-33E-48.000000G; part_type: osc; type: MEMs; height: 0.8mm; status: Obsolete

## Sheet PowerCore.SchDoc: Power Core
size 431 x 279 mm; DrawnBy: D. Bruey, M.Ciuffo; Organization: Synapse Product Development, LLC.; Address1: 1511 6th Ave., Suite 400; Address2: Seattle, Washington 98101; Address3: 206.381.0898; Address4: www.synapse.com; DocumentNumber: 6; SheetNumber: 6; SheetTotal: 10; PageSetup: Record=PageOptions|CenterHorizontal=True|CenterVertical=True|PrintScale=1.06|XCorrection=1.00|YCorrection=1.00|PrintKind=1|BorderSize=5000000|LeftOffset=0|BottomOffset=0|Orientation=2|PaperLength=4318|PaperWidth=2794|Scale=100|PaperSource=7|PrintQuality=200|MediaType=1|DitherType=10|PrintScaleMode=1|PaperKind=11x17|PaperIndex=3
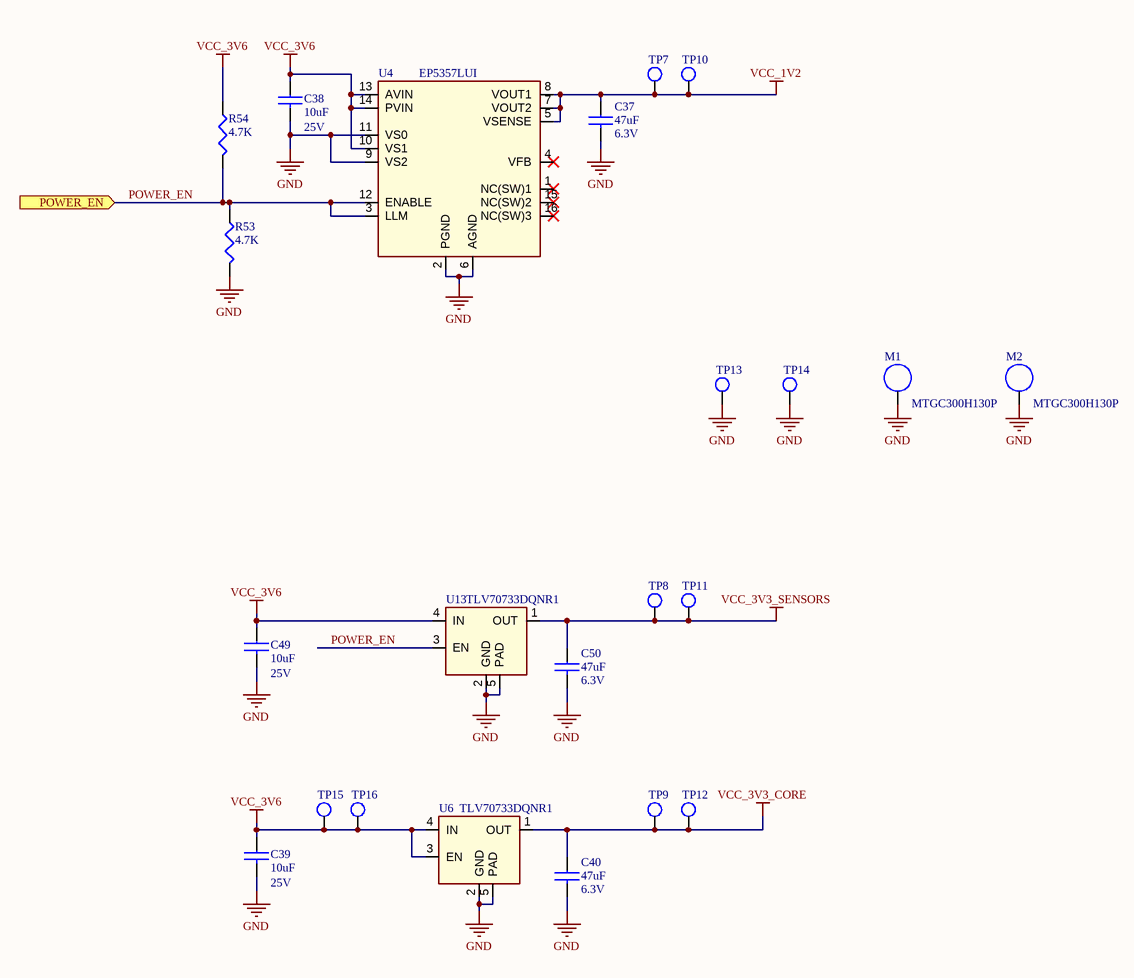
[diagram p5: PowerCore.SchDoc]

### Parts
C37  47uF  Voltage: 6.3V  [0805-ipcsm_145]
C38  10uF  Voltage: 25V  [0603-ipcsm_90]
C39  10uF  Voltage: 25V  [0603-ipcsm_90]
C40  47uF  Voltage: 6.3V  [0805-ipcsm_145]
C49  10uF  Voltage: 25V  [0603-ipcsm_90]
C50  47uF  Voltage: 6.3V  [0805-ipcsm_145]
M1  MTGC300H130P  [MTGC300H130P]  (no BOM)
M2  MTGC300H130P  [MTGC300H130P]  (no BOM)
R53  4.7K  [0201-IPCsm_26]
R54  4.7K  [0201-IPCsm_26]
TP7  tp-1mm  [TP-S100_SMT]  (value not drawn)  (no BOM)
TP8  tp-1mm  [TP-S100_SMT]  (value not drawn)  (no BOM)
TP9  tp-1mm  [TP-S100_SMT]  (value not drawn)  (no BOM)
TP10  tp-1mm  [TP-S100_SMT]  (value not drawn)  (no BOM)
TP11  tp-1mm  [TP-S100_SMT]  (value not drawn)  (no BOM)
TP12  tp-1mm  [TP-S100_SMT]  (value not drawn)  (no BOM)
TP13  tp-1mm  [TP-S100_SMT]  (value not drawn)  (no BOM)
TP14  tp-1mm  [TP-S100_SMT]  (value not drawn)  (no BOM)
TP15  tp-1mm  [TP-S100_SMT]  (value not drawn)  (no BOM)
TP16  tp-1mm  [TP-S100_SMT]  (value not drawn)  (no BOM)
U4  EP5357LUI  [qfn16_ep5357lui]
U6  TLV70733DQNR1  [son4_tlv707dqn]
U13  TLV70733DQNR1  [son4_tlv707dqn]

### Ports
POWER_EN (in)

### Nets
GND: C37.2 C38.2 C39.2 C40.2 C49.2 C50.2 M1.1 M2.1 R53.2 TP13.1(TP) TP14.1(TP) U4.2(PGND) U4.6(AGND) U4.9(VS2) U4.11(VS0) U6.2(GND) U6.5(PAD) U13.2(GND) U13.5(PAD)
VCC_1V2: C37.1 TP7.1(TP) TP10.1(TP) U4.5(VSENSE) U4.7(VOUT2) U4.8(VOUT1)
VCC_3V3_CORE: C40.1 TP9.1(TP) TP12.1(TP) U6.1(OUT)
VCC_3V3_SENSORS: C50.1 TP8.1(TP) TP11.1(TP) U13.1(OUT)
VCC_3V6: C38.1 C39.1 C49.1 R54.1 TP15.1(TP) TP16.1(TP) U4.10(VS1) U4.13(AVIN) U4.14(PVIN) U6.3(EN) U6.4(IN) U13.4(IN)
POWER_EN: R53.1 R54.2 U4.3(LLM) U4.12(ENABLE) U13.3(EN) ; port POWER_EN

Not connected (* = marked no-connect by the designer): U4 1(NC(SW)1)* 4(VFB)* 15(NC(SW)2)* 16(NC(SW)3)*

### Notes on the sheet
- Design Notes:
- Layout Notes:
- Project:
- Sheet Title:
- PCBA:
- PROPRIETARY AND CONFIDENTIAL
- Drawn by:
- Schematic Part Number:
- Schematic Revision:
- Date:
- Sheet:
- /

### Library data of the parts
C37 C40 C50 = GRM21BR60J476ME15L: CAP CER 47UF 6.3V X5R 0805; part_type: capacitor; id: 1283; mfg: Murata; dist: DIGIKEY; dist_pn: 490-9960-1-ND; TableName: viewAltiumCapacitors; mfg_pn: GRM21BR60J476ME15L; type: X5R; height: 1.45MM; status: Unknown
C38 C39 C49 = CL10A106MA8NRNC: as C19 on sheet FPGA_Power; mfg_pn: CL10A106MA8NRNC; type: X5R; tolerance: 20%; height: 0.9MM; status: Unknown
M1 M2 = MTGC300H130P: MTG, 3.00 mm Pad, 1.30 mm throughhole, PLATED; part_type: mounting; id: 1180; TableName: viewAltiumMisc; mfg_pn: MTGC300H130P; dist_pn: N/A; source_package: MTGC300H130P; height: 0.05MM; status: Unknown
R53 R54 = ERJ-1GEF4701C: RES 4.70K OHM 1/20W 1% 0201 SMD; part_type: resistor; Tolerance: 1.00%; DIST: DIGIKEY; MFG: PANASONIC; DIST_PN: P4.7KABCT-ND; id: 1110; source_package: R_ 4.7K_1P_0201; TableName: viewAltiumResistors; Height: 0.26MM; MFG_PN: ERJ-1GEF4701C; status: Unknown
TP7-TP16 = TP0042: as TP1 on sheet FPGA_IO; dist: NA; dist_pn: NA; source_package: tp_smt; status: Unknown
U4 = EP5357LUI: DC/DC CONVERTER 0.6-5.2V 3W; part_type: IC; id: 2396; mfg: Altera; dist: Digikey; dist_pn: 544-2869-1-ND; symbol: \\SYNAPSEDEV.COM\DFS\FS\EE_STUFF\CAD_LIB\MASTER\MASTER_IC\EP5357LUI; voltage: 2.4V~5.5V; OrCADSymbol: MASTER_IC\EP5357LUI; TableName: viewAltiumIcs; mfg_pn: EP5357LUI; allegro_footprint: qfn16_ep5357lui; height: 1.1mm; power: 3W; status: Unknown; datasheet: https://www.altera.com/content/dam/altera-www/global/en_US/pdfs/literature/ds/ep5357_03409.pdf; SymbolPath: C:\EE-Vault\Libraries\Schematic\MASTER_IC\EP5357LUI
U6 U13 = TLV70733DQNR1: IC REG LDO 3.3V 0.2A 4X2SON; id: 2394; mfg: TI; dist: DIGIKEY; dist_pn: 296-40637-1-ND; symbol: \\SYNAPSEDEV.COM\DFS\FS\EE_STUFF\CAD_LIB\MASTER\MASTER_IC\TLV707XX; voltage: 2V~5.5V; OrCADSymbol: MASTER_IC\TLV707XX; TableName: viewAltiumIcs; mfg_pn: TLV70733DQNR1; part_type: ic; allegro_footprint: son4_tlv707dqn; source_package: TLV70733DQNR1; height: 0.4mm; power: 0.2A; status: Unknown; datasheet: http://www.ti.com/lit/ds/symlink/tlv707.pdf; SymbolPath: C:\EE-Vault\Libraries\Schematic\MASTER_IC\TLV707XX

## Sheet MCU_IMU.SchDoc: MCU and IMU
size 431 x 279 mm; DrawnBy: D. Bruey, M.Ciuffo; Organization: Synapse Product Development, LLC.; Address1: 1511 6th Ave., Suite 400; Address2: Seattle, Washington 98101; Address3: 206.381.0898; Address4: www.synapse.com; DocumentNumber: 7; SheetNumber: 5; SheetTotal: 10; PageSetup: Record=PageOptions|CenterHorizontal=True|CenterVertical=True|PrintScale=0.96|XCorrection=1.00|YCorrection=1.00|PrintKind=1|BorderSize=5000000|LeftOffset=0|BottomOffset=0|Orientation=2|PaperLength=4318|PaperWidth=2794|Scale=100|PaperSource=7|PrintQuality=200|MediaType=1|DitherType=10|PrintScaleMode=1|PaperKind=11x17|PaperIndex=3
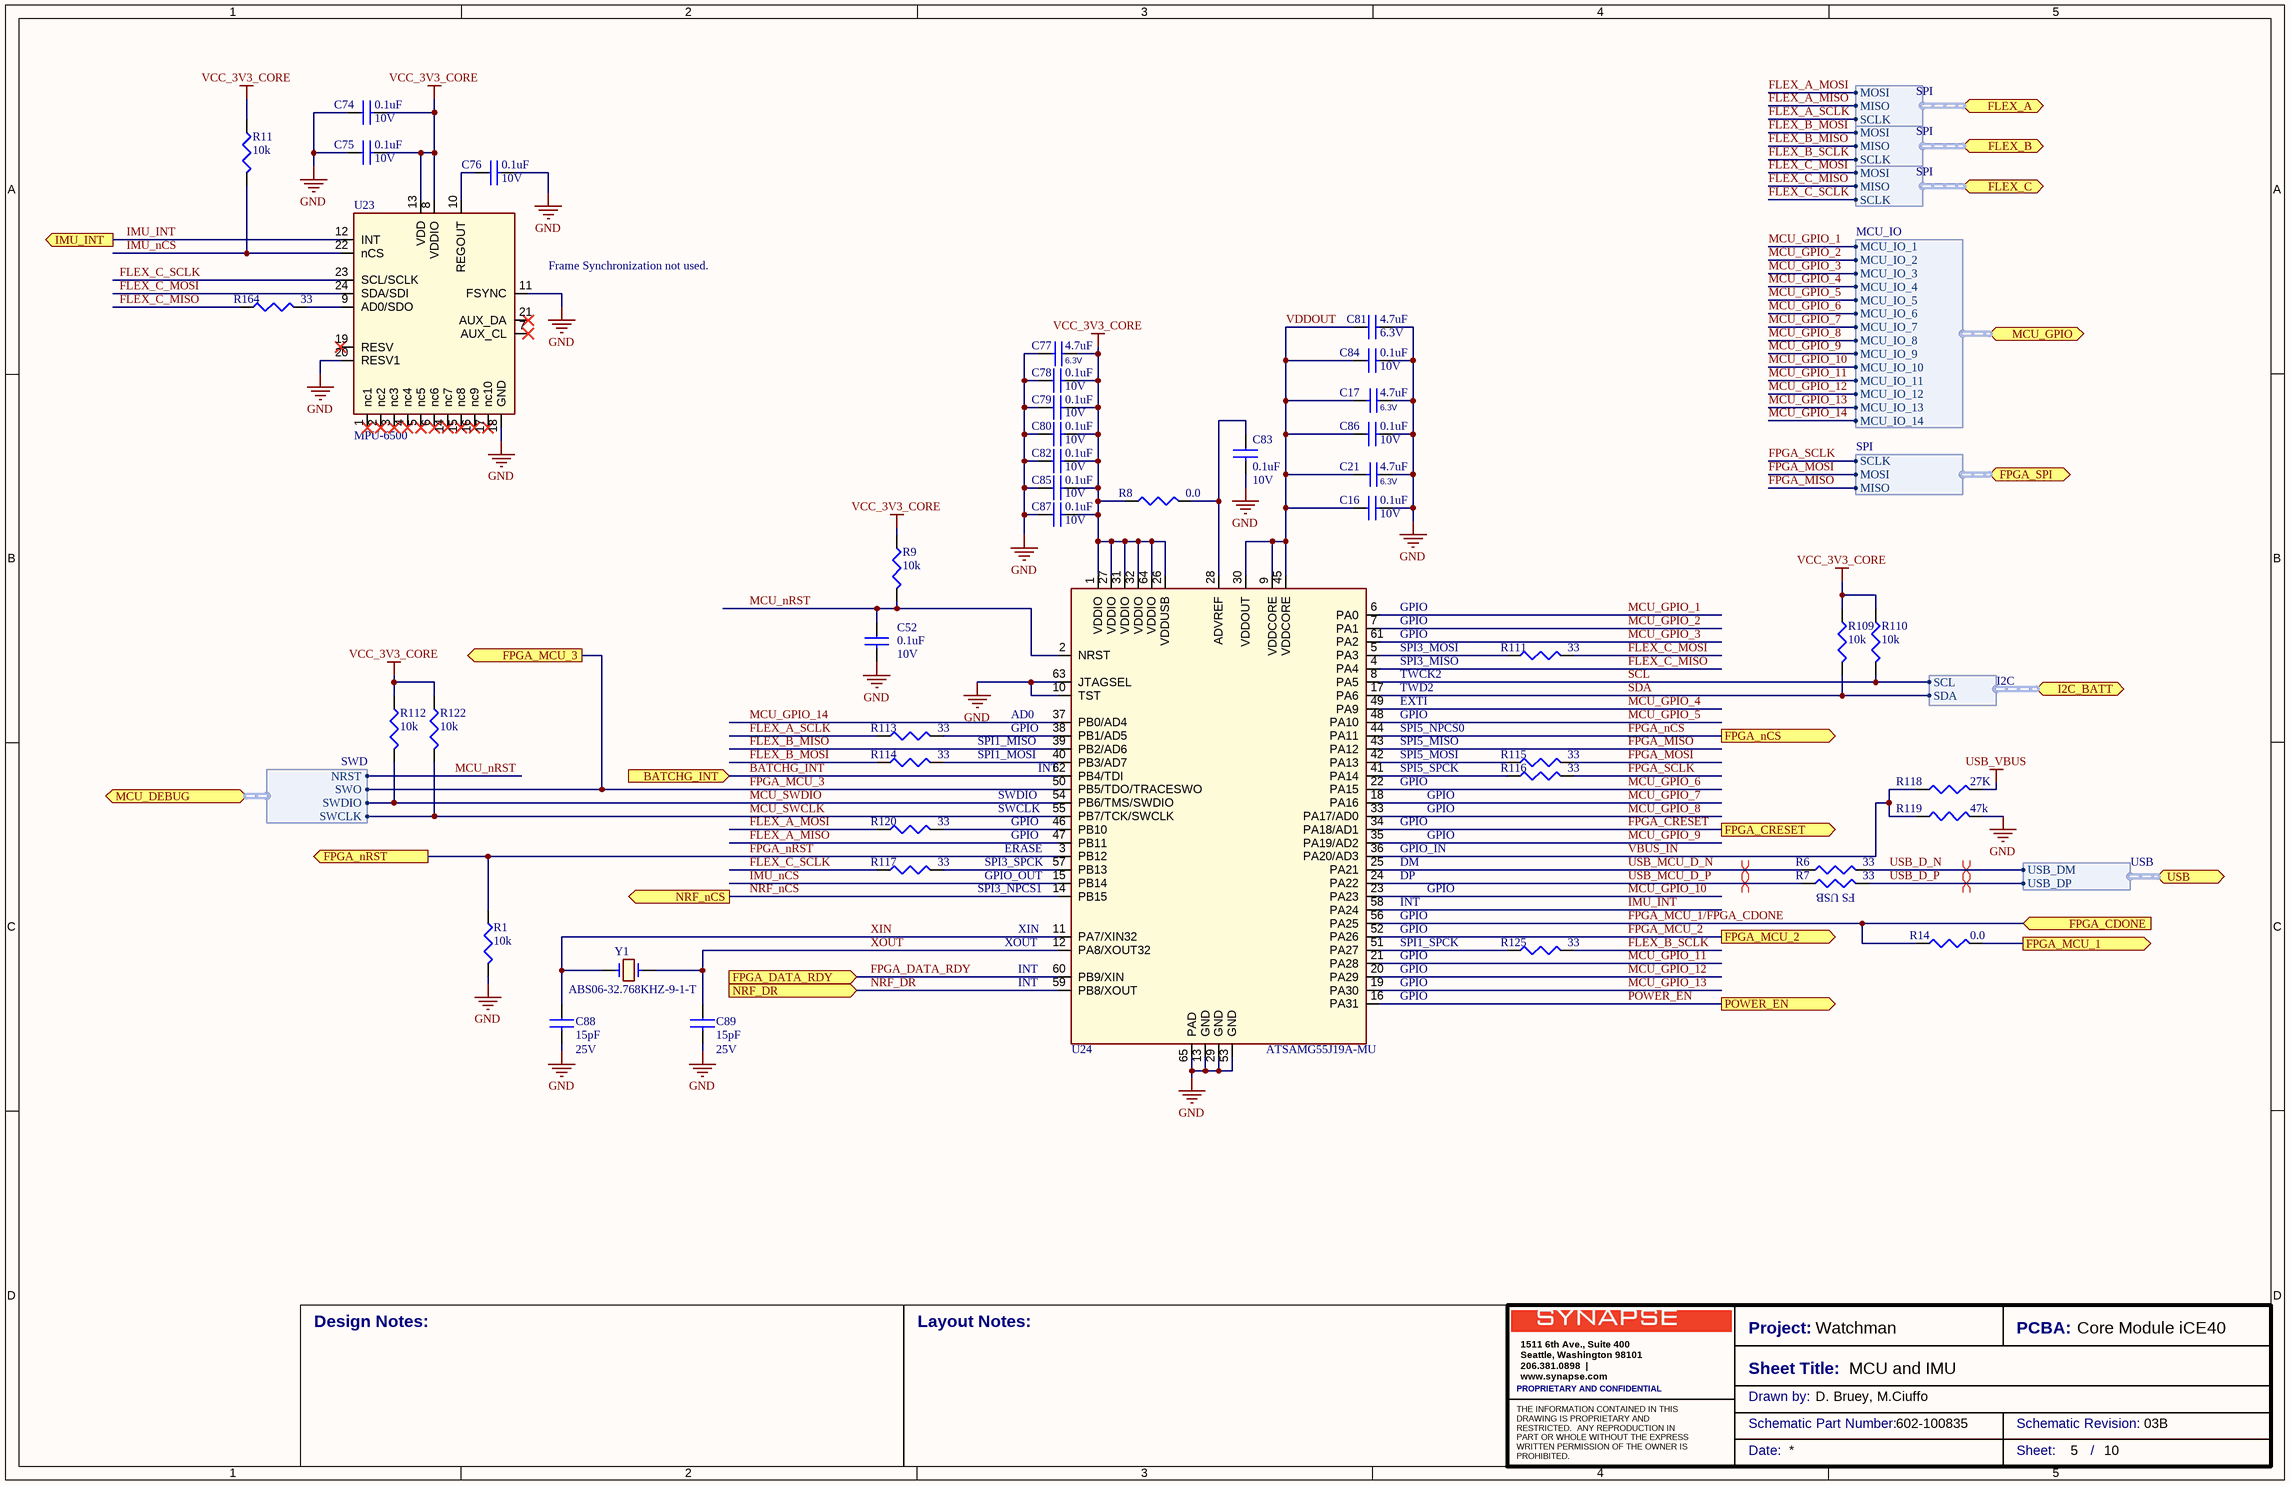
[diagram p6: MCU_IMU.SchDoc]

### Parts
C16  0.1uF  Voltage: 10V  [0201-IPCsm_33]
C17  4.7uF  Voltage: 6.3V  [0402-IPCsm_55]
C21  4.7uF  Voltage: 6.3V  [0402-IPCsm_55]
C52  0.1uF  Voltage: 10V  [0201-IPCsm_33]
C74  0.1uF  Voltage: 10V  [0201-IPCsm_33]
C75  0.1uF  Voltage: 10V  [0201-IPCsm_33]
C76  0.1uF  Voltage: 10V  [0201-IPCsm_33]
C77  4.7uF  Voltage: 6.3V  [0402-IPCsm_55]
C78  0.1uF  Voltage: 10V  [0201-IPCsm_33]
C79  0.1uF  Voltage: 10V  [0201-IPCsm_33]
C80  0.1uF  Voltage: 10V  [0201-IPCsm_33]
C81  4.7uF  Voltage: 6.3V  [0402-IPCsm_55]
C82  0.1uF  Voltage: 10V  [0201-IPCsm_33]
C83  0.1uF  Voltage: 10V  [0201-IPCsm_33]
C84  0.1uF  Voltage: 10V  [0201-IPCsm_33]
C85  0.1uF  Voltage: 10V  [0201-IPCsm_33]
C86  0.1uF  Voltage: 10V  [0201-IPCsm_33]
C87  0.1uF  Voltage: 10V  [0201-IPCsm_33]
C88  15pF  Voltage: 25V  [0201-IPCsm_33]
C89  15pF  Voltage: 25V  [0201-IPCsm_33]
R1  10k  [0201-IPCsm_26]
R6  33  [0201-IPCsm_26]
R7  33  [0201-IPCsm_26]
R8  0.0  [0201-IPCsm_26]
R9  10k  [0201-IPCsm_26]
R11  10k  [0201-IPCsm_26]
R14  0.0  [0201-IPCsm_26]
R109  10k  [0201-IPCsm_26]
R110  10k  [0201-IPCsm_26]
R111  33  [0201-IPCsm_26]
R112  10k  [0201-IPCsm_26]
R113  33  [0201-IPCsm_26]
R114  33  [0201-IPCsm_26]
R115  33  [0201-IPCsm_26]
R116  33  [0201-IPCsm_26]
R117  33  [0201-IPCsm_26]
R118  27K  [0201-IPCsm_26]
R119  47k  [0201-IPCsm_26]
R120  33  [0201-IPCsm_26]
R122  10k  [0201-IPCsm_26]
R125  33  [0201-IPCsm_26]
R164  33  [0201-IPCsm_26]
U23  MPU-6500  [QFN24_mpu-6500_3x3]
U24  ATSAMG55J19A-MU  [qfn64_atsamg55j19a_no_vias]
Y1  ABS06-32.768KHZ-9-1-T  [xtal_abs06]

### Ports
BATCHG_INT (in), FLEX_A (harness SPI), FLEX_B (harness SPI), FLEX_C (harness SPI), FPGA_CDONE (in), FPGA_CRESET (out), FPGA_DATA_RDY (in), FPGA_MCU_1 (out), FPGA_MCU_2 (out), FPGA_MCU_3 (out), FPGA_nCS (out), FPGA_nRST (out), FPGA_SPI (harness SPI), I2C_BATT (harness I2C), IMU_INT (out), MCU_DEBUG (harness SWD), MCU_GPIO (harness MCU_IO), NRF_DR (in), NRF_nCS (out), POWER_EN (out), USB (harness USB)

### Harnesses
SWD: NRST, SWCLK, SWDIO, SWO
USB: USB_DM, USB_DP
I2C: SDA, SCL
MCU_IO: MCU_IO_1, MCU_IO_2, MCU_IO_3, MCU_IO_4, MCU_IO_5, MCU_IO_6, MCU_IO_7, MCU_IO_8, MCU_IO_9, MCU_IO_10, MCU_IO_11, MCU_IO_12, MCU_IO_13, MCU_IO_14
SPI: MOSI, MISO, SCLK

### Nets
GND: C16.2 C17.1 C21.1 C52.2 C74.1 C75.1 C76.2 C77.2 C78.1 C79.1 C80.1 C81.2 C82.1 C83.2 C84.2 C85.1 C86.2 C87.1 C88.2 C89.2 R1.2 R119.2 U23.11(FSYNC) U23.18(GND) U23.20(RESV1) U24.10(TST) U24.13(GND) U24.29(GND) U24.53(GND) U24.63(JTAGSEL) U24.65(PAD)
USB_VBUS: R118.2
VCC_3V3_CORE: C74.2 C75.2 C77.1 C78.2 C79.2 C80.2 C82.2 C85.2 C87.2 R8.1 R9.1 R11.1 R109.1 R110.1 R112.1 R122.1 U23.8(VDDIO) U23.13(VDD) U24.1(VDDIO) U24.26(VDDUSB) U24.27(VDDIO) U24.31(VDDIO) U24.32(VDDIO) U24.64(VDDIO)
BATCHG_INT: U24.62(PB4/TDI) ; port BATCHG_INT
FLEX_A_MISO: U24.47(PB11) ; port FLEX_A.MISO
FLEX_A_MOSI: R120.1 ; port FLEX_A.MOSI
FLEX_A_SCLK: R113.1 ; port FLEX_A.SCLK
FLEX_B_MISO: U24.39(PB2/AD6) ; port FLEX_B.MISO
FLEX_B_MOSI: R114.1 ; port FLEX_B.MOSI
FLEX_B_SCLK: R125.2 ; port FLEX_B.SCLK
FLEX_C_MISO: R164.1 U24.4(PA4) ; port FLEX_C.MISO
FLEX_C_MOSI: R111.2 U23.24(SDA/SDI) ; port FLEX_C.MOSI
FLEX_C_SCLK: R117.1 U23.23(SCL/SCLK) ; port FLEX_C.SCLK
FPGA_CRESET: U24.34(PA18/AD1) ; port FPGA_CRESET
FPGA_DATA_RDY: U24.60(PB9/XIN) ; port FPGA_DATA_RDY
FPGA_MCU_1: R14.1 ; port FPGA_MCU_1
FPGA_MCU_1/FPGA_CDONE: R14.2 U24.56(PA25) ; port FPGA_CDONE  [project net FPGA_CDONE]
FPGA_MCU_2: U24.52(PA26) ; port FPGA_MCU_2
FPGA_MCU_3: U24.50(PB5/TDO/TRACESWO) ; port FPGA_MCU_3, port MCU_DEBUG.SWO
FPGA_MISO: U24.43(PA12) ; port FPGA_SPI.MISO
FPGA_MOSI: R115.2 ; port FPGA_SPI.MOSI
FPGA_nCS: U24.44(PA11) ; port FPGA_nCS
FPGA_nRST: R1.1 U24.3(PB12) ; port FPGA_nRST
FPGA_SCLK: R116.2 ; port FPGA_SPI.SCLK
IMU_INT: U23.12(INT) U24.58(PA24) ; port IMU_INT
IMU_nCS: R11.2 U23.22(nCS) U24.15(PB14)
MCU_GPIO_1: U24.6(PA0) ; port MCU_GPIO.MCU_IO_1
MCU_GPIO_2: U24.7(PA1) ; port MCU_GPIO.MCU_IO_2
MCU_GPIO_3: U24.61(PA2) ; port MCU_GPIO.MCU_IO_3
MCU_GPIO_4: U24.49(PA9) ; port MCU_GPIO.MCU_IO_4
MCU_GPIO_5: U24.48(PA10) ; port MCU_GPIO.MCU_IO_5
MCU_GPIO_6: U24.22(PA15) ; port MCU_GPIO.MCU_IO_6
MCU_GPIO_7: U24.18(PA16) ; port MCU_GPIO.MCU_IO_7
MCU_GPIO_8: U24.33(PA17/AD0) ; port MCU_GPIO.MCU_IO_8
MCU_GPIO_9: U24.35(PA19/AD2) ; port MCU_GPIO.MCU_IO_9
MCU_GPIO_10: U24.23(PA23) ; port MCU_GPIO.MCU_IO_10
MCU_GPIO_11: U24.21(PA28) ; port MCU_GPIO.MCU_IO_11
MCU_GPIO_12: U24.20(PA29) ; port MCU_GPIO.MCU_IO_12
MCU_GPIO_13: U24.19(PA30) ; port MCU_GPIO.MCU_IO_13
MCU_GPIO_14: U24.37(PB0/AD4) ; port MCU_GPIO.MCU_IO_14
MCU_nRST: C52.1 R9.2 U24.2(NRST) ; port MCU_DEBUG.NRST
MCU_SWCLK: R122.2 U24.55(PB7/TCK/SWCLK) ; port MCU_DEBUG.SWCLK
MCU_SWDIO: R112.2 U24.54(PB6/TMS/SWDIO) ; port MCU_DEBUG.SWDIO
NRF_DR: U24.59(PB8/XOUT) ; port NRF_DR
NRF_nCS: U24.14(PB15) ; port NRF_nCS
POWER_EN: U24.16(PA31) ; port POWER_EN
SCL: R110.2 U24.8(PA5) ; port I2C_BATT.SCL
SDA: R109.2 U24.17(PA6) ; port I2C_BATT.SDA
USB_D_N: R6.2 ; port USB.USB_DM
USB_D_P: R7.2 ; port USB.USB_DP
USB_MCU_D_N: R6.1 U24.25(PA21)
USB_MCU_D_P: R7.1 U24.24(PA22)
VBUS_IN: R118.1 R119.1 U24.36(PA20/AD3)
VDDOUT: C16.1 C17.2 C21.2 C81.1 C84.1 C86.1 U24.9(VDDCORE) U24.30(VDDOUT) U24.45(VDDCORE)
XIN: C88.1 U24.11(PA7/XIN32) Y1.1
XOUT: C89.1 U24.12(PA8/XOUT32) Y1.2
NetC76_1: C76.1 U23.10(REGOUT)
NetC83_1: C83.1 R8.2 U24.28(ADVREF)
NetR111_1: R111.1 U24.5(PA3)
NetR113_2: R113.2 U24.38(PB1/AD5)
NetR114_2: R114.2 U24.40(PB3/AD7)
NetR115_1: R115.1 U24.42(PA13)
NetR116_1: R116.1 U24.41(PA14)
NetR117_2: R117.2 U24.57(PB13)
NetR120_2: R120.2 U24.46(PB10)
NetR125_1: R125.1 U24.51(PA27)
NetR164_2: R164.2 U23.9(AD0/SDO)

Not connected (* = marked no-connect by the designer): U23 1(nc1)* 2(nc2)* 3(nc3)* 4(nc4)* 5(nc5)* 6(nc6)* 7(AUX_CL)* 14(nc7)* 15(nc8)* 16(nc9)* 17(nc10)* 19(RESV)* 21(AUX_DA)*

### Layout directives
differential pair: USB_D_N, USB_D_P, USB_MCU_D_N, USB_MCU_D_P

### Notes on the sheet
- (near U23) Frame Synchronization not used.
- (near U24) GPIO
- (near U24) TWD2
- (near U24) EXTI
- (near U24) TWCK2
- (near U24) SPI3_MISO
- (near U24) SPI3_MOSI
- SPI1_MISO
- SPI1_MOSI
- (near U24) AD0
- (near U24) SPI5_MISO
- (near U24) SPI5_MOSI
- (near U24) SPI5_NPCS0
- (near U24) SWDIO
- SWCLK
- (near U24) INT
- (near U24) SPI5_SPCK
- SPI3_NPCS1
- (near U24) SPI3_SPCK
- GPIO_OUT
- (near U24) ERASE
- (near U24) DM
- (near U24) DP
- (near U24) GPIO_IN
- (near R7) FS USB
- (near U24) XOUT
- (near U24) XIN
- (near U24) SPI1_SPCK
- Design Notes:
- Layout Notes:
- Project:
- Sheet Title:
- PCBA:
- PROPRIETARY AND CONFIDENTIAL
- Drawn by:
- Schematic Part Number:
- Schematic Revision:
- Date:
- Sheet:
- /

### Library data of the parts
C16 C52 C74-C76 C78-C80 C82-C87 = CL03A104KP3NNNC: as C2 on sheet FPGA_Power; mfg_pn: CL03A104KP3NNNC; type: X5R; tolerance: 10%; height: 0.33mm; status: Unknown
C17 C21 C77 = GRM155R60J475ME47D: as C1 on sheet FPGA_Power; mfg_pn: GRM155R60J475ME47D; type: X5R; tolerance: 20%; height: 0.55MM; status: Unknown; SymbolPath: C:\EE-Vault\Libraries\Schematic\MASTER_DISCRETE\CAP
C81 = GRM155R60J475ME47D: CAP CER 4.7UF 6.3V 20% X5R 0402; part_type: capacitor; id: 855; mfg: MURATA; dist: DIGIKEY; dist_pn: 490-5915-1-ND; source_package: C_4P7U_6.3V_X5R_0402; TableName: viewAltiumCapacitors; mfg_pn: GRM155R60J475ME47D; type: X5R; tolerance: 20%; height: 0.55MM; status: Unknown
C88 C89 = GRM0335C1E150JA01D: CAP CER 15PF 25V C0G 0201; part_type: capacitor; id: 1280; mfg: Murata; dist: Digikey; dist_pn: 490-9658-1-ND; source_package: C_15p_25V_C0G_0201; type: C0G, NPO; tolerance: 5%; history: Created from GRM0335C1E150JD01D, 01-06-2016; where_used: MB2.1; TableName: viewAltiumCapacitors; mfg_pn: GRM0335C1E150JA01D; height: 0.33MM; status: Good
R1 R9 R11 R109 R110 R112 R122 = RC0201FR-0710KL: as R2 on sheet FPGA_IO; Height: .26MM; MFG_PN: RC0201FR-0710KL; status: Unknown
R6 R7 R111 R113-R117 R120 R125 R164 = RC0201FR-0733R: as R10 on sheet FPGA_IO; Height: .26MM; MFG_PN: RC0201FR-0733R; status: Unknown
R8 R14 = ERJ-1GE0R00C: RES SMD 0.0OHM JUMPER 1/20W 0201; part_type: resistor; DIST: Digikey; MFG: Panasonic; DIST_PN: P0.0AGCT-ND; Power: 0.05W; id: 2380; TableName: viewAltiumResistors; Height: 0.26MM; MFG_PN: ERJ-1GE0R00C; status: Unknown
R118 = ERJ-1GEF2702C: RES 27K OHM 1/20W 1% 0201 SMD; part_type: resistor; Tolerance: 1.00%; Voltage: 15V; DIST: Digikey; MFG: Panasonic; DIST_PN: P27.0KABCT-ND; Power: 0.05W; id: 2159; source_package: R_27K_1p_0201; TableName: viewAltiumResistors; Height: 0.26mm; MFG_PN: ERJ-1GEF2702C; status: Unknown
R119 = RC0201JR-0747KL: RES 47K OHM 1/20W 5% 0201 SMD; part_type: resistor; Tolerance: 5.00%; Voltage: 50V; DIST: DIGIKEY; MFG: YAGEO; DIST_PN: 311-47KNCT-ND; Power: 0.05W; id: 1523; source_package: R_47k_0201_5P; TableName: viewAltiumResistors; Height: .26MM; MFG_PN: RC0201JR-0747KL; status: Unknown
U23 = MPU-6500: 6-axis Gyroscope/Accelerometer; part_type: ic; id: 1823; mfg: InvenSense; symbol: \\SYNAPSEDEV.COM\DFS\FS\EE_STUFF\CAD_LIB\MASTER\MASTER_IC\MPU-6500a; allegro_footprint: qfn40p300x300x95-24s; OrCADSymbol: MASTER_IC\MPU-6500A; TableName: viewAltiumIcs; mfg_pn: MPU-6500; dist: InvenSense; dist_pn: MPU-6500; source_package: MPU-6500a; status: Unknown; SymbolPath: C:\EE-Vault\Libraries\Schematic\MASTER_IC\MPU-6500A
U24 = ATSAMG55J19A-MU: IC MCU 32BIT 512KB FLASH 64VQFN; id: 2421; mfg: Atmel; voltage: 1.62V~3.6V; TableName: viewAltiumIcs; mfg_pn: ATSAMG55J19A-MU; dist: ATMEL; dist_pn: ATSAMG55J19A-MU; part_type: ic; source_package: ATSAMG55J19A-MU; height: .85mm; status: Unknown; datasheet: http://www.atmel.com/Images/Atmel-11289-32-bit-Cortex-M4-Microcontroller-SAM-G55_Datasheet.pdf
Y1 = ABS06-32.768KHZ-9-1-T: CRYSTAL 32.768 KHZ 9PF SMD; id: 847; mfg: Abracon; dist: Digikey; dist_pn: 535-10247-1-ND; source_package: ABS06; tolerance: +/- 10ppm; TableName: viewAltiumMisc; mfg_pn: ABS06-32.768KHZ-9-1-T; part_type: crystal; height: 0.6mm; status: Unknown